# EAGLE schematic new_garage (EAGLE 5.11)
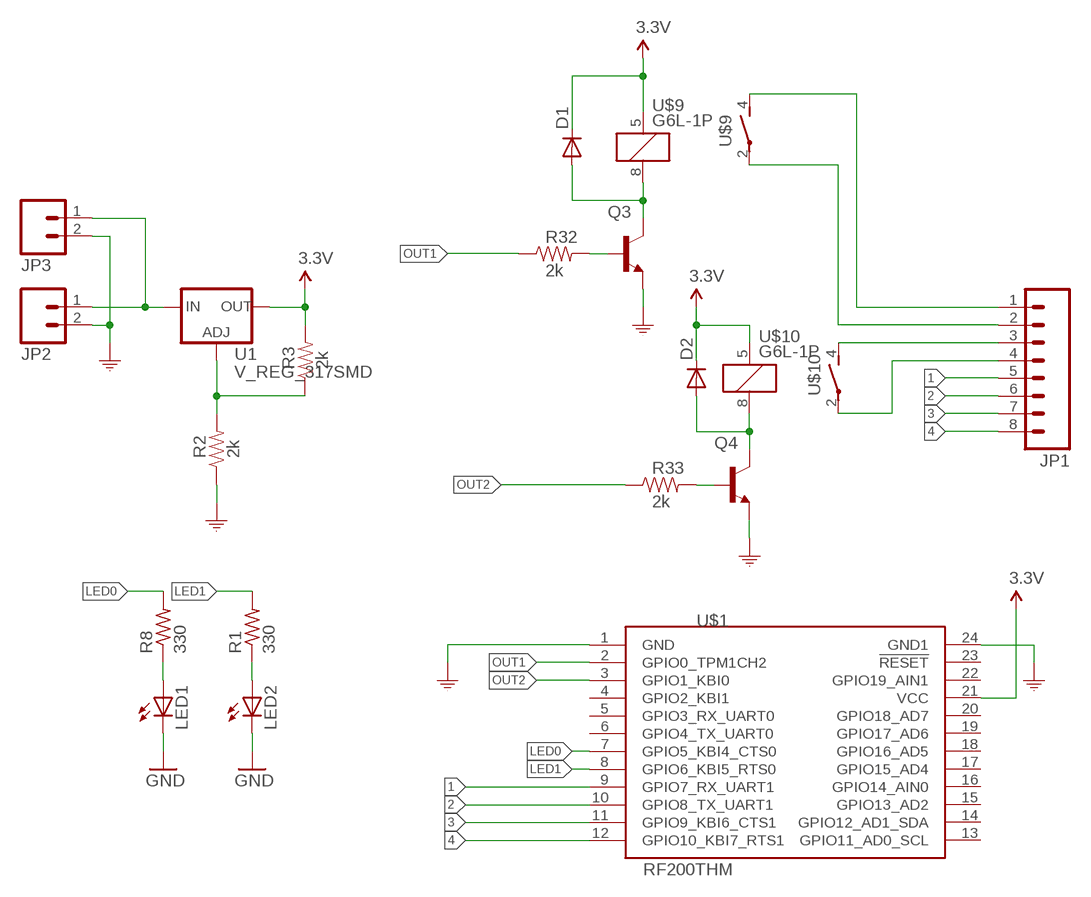
[diagram p0: schematic, sheet 1]

## Parts
D1  DIODESOD  [SOD-323]
D2  DIODESOD  [SOD-323]
JP1  M083.5MM-8  [SCREWTERMINAL-3.5MM-8]
JP2  M023.5MM  [SCREWTERMINAL-3.5MM-2]
JP3  M02-JST-2MM-SMT  [JST-2-SMD]
LED1  LEDCHIP-LED0603  [CHIP-LED0603]
LED2  LEDCHIP-LED0603  [CHIP-LED0603]
Q3  TRANSISTOR_NPNSOT23  [SOT23]
Q4  TRANSISTOR_NPNSOT23  [SOT23]
R1  330  R-US_R0402  [R0402]
R2  2k  RESISTOR0603  [0603]
R3  2k  RESISTOR0603  [0603]
R8  330  R-US_R0402  [R0402]
R32  2k  RESISTOR0603  [0603]
R33  2k  RESISTOR0603  [0603]
U1  V_REG_317SMD  [SOT223]
U$1  RF200THM  [SYNAPSERFENGINE-THM]
U$9  G6L-1P  [G6L-1F]
U$10  G6L-1P  [G6L-1F]

## Nets
1: JP1.5 U$1.9(GPIO7_RX_UART1)
2: JP1.6 U$1.10(GPIO8_TX_UART1)
3: JP1.7 U$1.11(GPIO9_KBI6_CTS1)
3.3V [Power]: D1.1(C) D2.1(C) R3.2 U1.2(OUT) U$1.21(VCC) U$9.5 U$10.5
4: JP1.8 U$1.12(GPIO10_KBI7_RTS1)
GND [GND]: JP2.2 JP3.2 LED1.C LED2.C Q3.2(E) Q4.2(E) R2.1 U$1.1(GND) U$1.24(GND1) ; supply symbol labelled GND1
LED0: R8.2 U$1.7(GPIO5_KBI4_CTS0)
LED1: R1.2 U$1.8(GPIO6_KBI5_RTS0)
N$1: LED2.A R1.1
N$2: R2.2 R3.1 U1.1(ADJ)
N$9: JP2.1 JP3.1 U1.3(IN)
N$10: LED1.A R8.1
N$16: D1.2(A) Q3.3(C) U$9.8
N$18: Q3.1(B) R32.2
N$21: JP1.1 U$9.4(CONTACT:S)
N$22: JP1.2 U$9.2(CONTACT:P)
N$23: JP1.3 U$10.4(CONTACT:S)
N$24: JP1.4 U$10.2(CONTACT:P)
N$25 [GND]: D2.2(A) Q4.3(C) U$10.8
N$26: Q4.1(B) R33.2
OUT1: R32.1 U$1.2(GPIO0_TPM1CH2)
OUT2: R33.1 U$1.3(GPIO1_KBI0)
Unconnected: U$1.4(GPIO2_KBI1) U$1.5(GPIO3_RX_UART0) U$1.6(GPIO4_TX_UART0) U$1.13(GPIO11_AD0_SCL) U$1.14(GPIO12_AD1_SDA) U$1.15(GPIO13_AD2) U$1.16(GPIO14_AIN0) U$1.17(GPIO15_AD4) U$1.18(GPIO16_AD5) U$1.19(GPIO17_AD6) U$1.20(GPIO18_AD7) U$1.22(GPIO19_AIN1) U$1.23(!RESET)

## Library data of the parts
D1 D2 = SparkFun:DIODE: Diode These are standard reverse protection diodes and small signal diodes. SMA package can handle up to about 1A. SOD-323 can handle about 200mA. What the SOD-323 package when ordering, there are some mfgs out there that are 5-pin packages.
JP1 = SparkFun:M08: Header 8 Standard 8-pin 0.1" header. Use with straight break away headers (SKU : PRT-00116), right angle break away headers (PRT-00553), swiss pins (PRT-00743), machine pins (PRT-00117), and female headers (PRT-00115).
JP2 JP3 = SparkFun:M02: Header 2 Standard 2-pin 0.1" header. Use with straight break away headers (SKU : PRT-00116), right angle break away headers (PRT-00553), swiss pins (PRT-00743), machine pins (PRT-00117), and female headers (PRT-00115). Molex polarized connector foot print use with SKU : PRT-08233 with associated crimp pins and housings.
LED1 LED2 = adafruit:LED: LED OSRAM: - CHIPLED LG R971, LG N971, LY N971, LG Q971, LY Q971, LO R971, LY R971 LH N974, LH R974 LS Q976, LO Q976, LY Q976 LO Q996 - Hyper CHIPLED LW Q18S LB Q993, LB Q99A, LB R99A - SideLED LS A670, LO A670, LY A670, LG A670, LP A670 LB A673, LV A673, LT A673, LW A673 LH A674 LY A675 LS A676, LA A676, LO A676, LY A676, LW A676 LS A679, LY A679, LG A679 - Hyper Micro SIDELED® LS Y876, LA Y876, LO Y876, LY Y876 LT Y87S - SmartLED LW L88C, LW L88S LB L89C, LB L89S, LG L890 LS L89K, LO L89K, LY L89K LS L896, LA L896, LO L896, LY L896 - TOPLED LS T670, LO T670, LY T670, LG T670, LP T670 LSG T670, LSP T670, LSY T670, LOP T670, LYG T670 LG T671, LOG T671, LSG T671 LB T673, LV T673, LT T673, LW T673 LH T674 LS T676, LA T676, LO T676, LY T676, LB T676, LH T676, LSB T676, LW T676 LB T67C, LV T67C, LT T67C, LS T67K, LO T67K, LY T67K, LW E67C LS E67B, LA E67B, LO E67B, LY E67B, LB E67C, LV E67C, LT E67C LW T67C LS T679, LY T679, LG T679 LS T770, LO T770, LY T770, LG T770, LP T770 LB T773, LV T773, LT T773, LW T773 LH T774 LS E675, LA E675, LY E675, LS T675 LS T776, LA T776, LO T776, LY T776, LB T776 LHGB T686 LT T68C, LB T68C - Hyper Mini TOPLED® LB M676 - Mini TOPLED Santana® LG M470 LS M47K, LO M47K, LY M47K Source: http://www.osram.convergy.de/
Q3 Q4 = SparkFunEagle-6-6-07:TRANSISTOR_NPN: Transistor NPN BJT configuration in SOT23 package. MMBT2222 is the common NPN we use. Double check BCE configuration again layout.
R1 R8 = adafruit:R-US_: RESISTOR, American symbol
R2 R3 R32 R33 = SparkFunEagle-6-6-07:RESISTOR: Resistor Basic schematic elements and footprints for 0603, 1206, and PTH 1/10th watt (small) resistors.
U1 = SparkFun:V_REG_317: Voltage Regulator Standard LM317 adjustable voltage regulator. AOI (Adjust Output Input). Google 'LM317 Calculator' for easy to use app to get the two resistor values needed. 240/720 for 5V output. 240/390 for 3.3V output. Spark Fun Electronics SKU : COM-00527
U$1 = Synapse-RFEngine:RF200
U$9 U$10 = michael:G6L-1P: SMT relay

## Net classes
0 default: width 0.203 mm, drill 0.203 mm, clearance 0.203 mm
1 Power: width 0.406 mm, drill 0.203 mm, clearance 0.203 mm
2 GND: width 0.406 mm, drill 0.203 mm, clearance 0.203 mm